# Altium schematic sheet SDRAM.SchDoc: SDRAM
size 420 x 297 mm; CompanyName: STMicroelectronics; Organization: Microcontrollers Division; DocumentNumber: 7; SheetNumber: 7; SheetTotal: 17
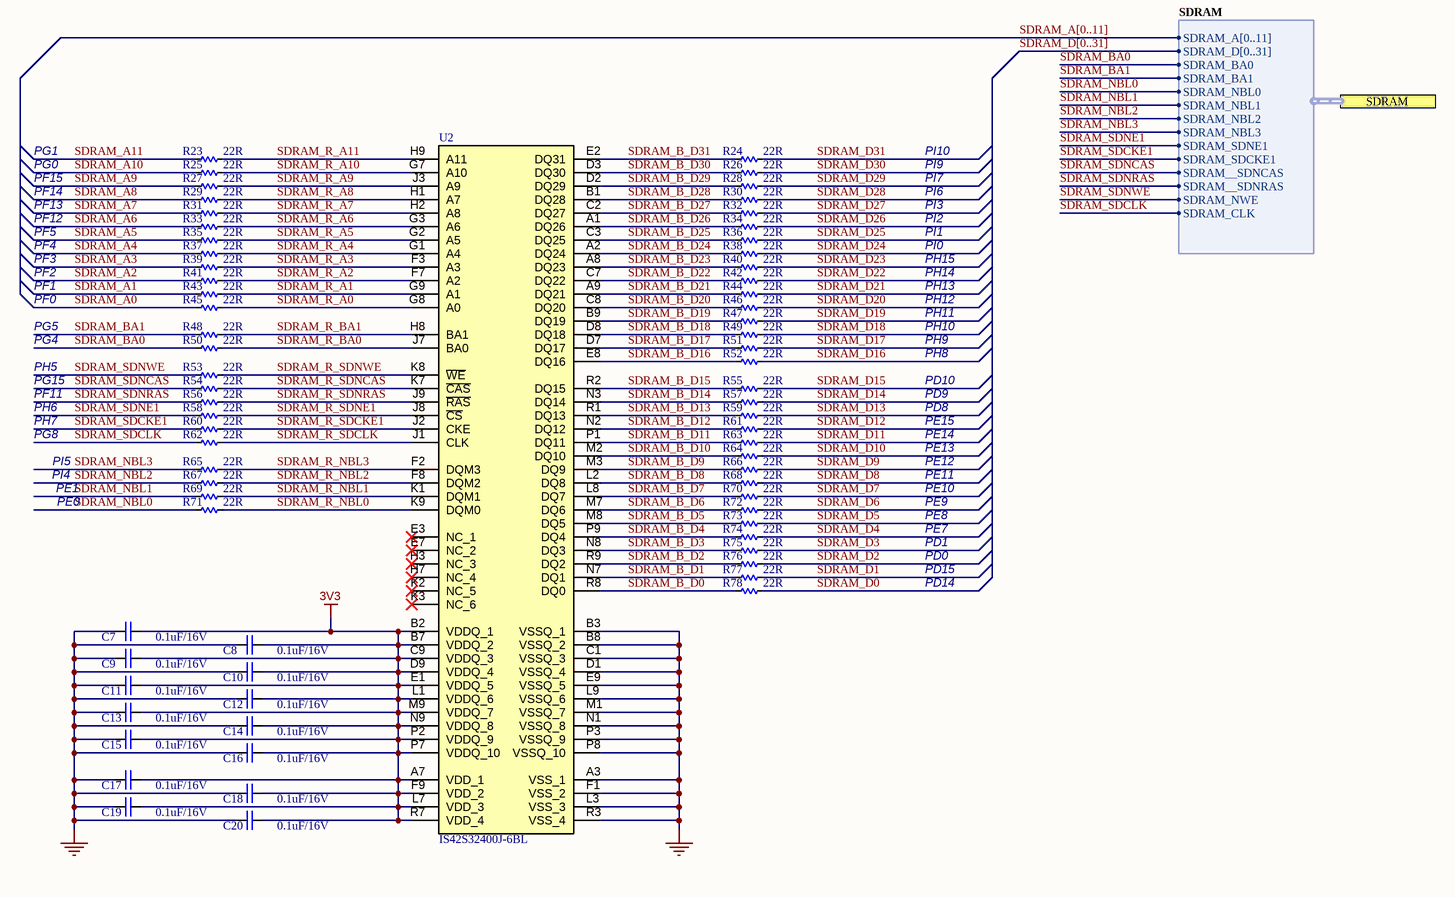
[diagram p0: SDRAM.SchDoc]

## Parts
C7  0.1uF/16V  [CAP_C_1608X80]
C8  0.1uF/16V  [CAP_C_1608X80]
C9  0.1uF/16V  [CAP_C_1608X80]
C10  0.1uF/16V  [CAP_C_1608X80]
C11  0.1uF/16V  [CAP_C_1608X80]
C12  0.1uF/16V  [CAP_C_1608X80]
C13  0.1uF/16V  [CAP_C_1608X80]
C14  0.1uF/16V  [CAP_C_1608X80]
C15  0.1uF/16V  [CAP_C_1608X80]
C16  0.1uF/16V  [CAP_C_1608X80]
C17  0.1uF/16V  [CAP_C_1608X80]
C18  0.1uF/16V  [CAP_C_1608X80]
C19  0.1uF/16V  [CAP_C_1608X80]
C20  0.1uF/16V  [CAP_C_1608X80]
R23  22R  [RES_C_1608X60]
R24  22R  [RES_C_1608X60]
R25  22R  [RES_C_1608X60]
R26  22R  [RES_C_1608X60]
R27  22R  [RES_C_1608X60]
R28  22R  [RES_C_1608X60]
R29  22R  [RES_C_1608X60]
R30  22R  [RES_C_1608X60]
R31  22R  [RES_C_1608X60]
R32  22R  [RES_C_1608X60]
R33  22R  [RES_C_1608X60]
R34  22R  [RES_C_1608X60]
R35  22R  [RES_C_1608X60]
R36  22R  [RES_C_1608X60]
R37  22R  [RES_C_1608X60]
R38  22R  [RES_C_1608X60]
R39  22R  [RES_C_1608X60]
R40  22R  [RES_C_1608X60]
R41  22R  [RES_C_1608X60]
R42  22R  [RES_C_1608X60]
R43  22R  [RES_C_1608X60]
R44  22R  [RES_C_1608X60]
R45  22R  [RES_C_1608X60]
R46  22R  [RES_C_1608X60]
R47  22R  [RES_C_1608X60]
R48  22R  [RES_C_1608X60]
R49  22R  [RES_C_1608X60]
R50  22R  [RES_C_1608X60]
R51  22R  [RES_C_1608X60]
R52  22R  [RES_C_1608X60]
R53  22R  [RES_C_1608X60]
R54  22R  [RES_C_1608X60]
R55  22R  [RES_C_1608X60]
R56  22R  [RES_C_1608X60]
R57  22R  [RES_C_1608X60]
R58  22R  [RES_C_1608X60]
R59  22R  [RES_C_1608X60]
R60  22R  [RES_C_1608X60]
R61  22R  [RES_C_1608X60]
R62  22R  [RES_C_1608X60]
R63  22R  [RES_C_1608X60]
R64  22R  [RES_C_1608X60]
R65  22R  [RES_C_1608X60]
R66  22R  [RES_C_1608X60]
R67  22R  [RES_C_1608X60]
R68  22R  [RES_C_1608X60]
R69  22R  [RES_C_1608X60]
R70  22R  [RES_C_1608X60]
R71  22R  [RES_C_1608X60]
R72  22R  [RES_C_1608X60]
R73  22R  [RES_C_1608X60]
R74  22R  [RES_C_1608X60]
R75  22R  [RES_C_1608X60]
R76  22R  [RES_C_1608X60]
R77  22R  [RES_C_1608X60]
R78  22R  [RES_C_1608X60]
U2  IS42S32400J-6BL  [BGA90C80P9X15_800X1300X120]

## Ports
SDRAM (harness SDRAM)

## Harnesses
SDRAM: SDRAM_A[0..11], SDRAM__SDNCAS, SDRAM_NBL0, SDRAM_SDNE1, SDRAM_SDCKE1, SDRAM_D[0..31], SDRAM_NBL1, SDRAM_BA0, SDRAM_BA1, SDRAM_NWE, SDRAM_CLK, SDRAM__SDNRAS, SDRAM_NBL3, SDRAM_NBL2

## Nets
3V3: C7.2 C8.2 C9.2 C10.2 C11.2 C12.2 C13.2 C14.2 C15.2 C16.2 C17.2 C18.2 C19.2 C20.2 U2.A7(VDD_1) U2.B2(VDDQ_1) U2.B7(VDDQ_2) U2.C9(VDDQ_3) U2.D9(VDDQ_4) U2.E1(VDDQ_5) U2.F9(VDD_2) U2.L1(VDDQ_6) U2.L7(VDD_3) U2.M9(VDDQ_7) U2.N9(VDDQ_8) U2.P2(VDDQ_9) U2.P7(VDDQ_10) U2.R7(VDD_4)
GND: C7.1 C8.1 C9.1 C10.1 C11.1 C12.1 C13.1 C14.1 C15.1 C16.1 C17.1 C18.1 C19.1 C20.1 U2.A3(VSS_1) U2.B3(VSSQ_1) U2.B8(VSSQ_2) U2.C1(VSSQ_3) U2.D1(VSSQ_4) U2.E9(VSSQ_5) U2.F1(VSS_2) U2.L3(VSS_3) U2.L9(VSSQ_6) U2.M1(VSSQ_7) U2.N1(VSSQ_8) U2.P3(VSSQ_9) U2.P8(VSSQ_10) U2.R3(VSS_4)
SDRAM_A0: R45.1
SDRAM_A1: R43.1
SDRAM_A2: R41.1
SDRAM_A3: R39.1
SDRAM_A4: R37.1
SDRAM_A5: R35.1
SDRAM_A6: R33.1
SDRAM_A7: R31.1
SDRAM_A8: R29.1
SDRAM_A9: R27.1
SDRAM_A10: R25.1
SDRAM_A11: R23.1
SDRAM_B_D0: R78.1 U2.R8(DQ0)
SDRAM_B_D1: R77.1 U2.N7(DQ1)
SDRAM_B_D2: R76.1 U2.R9(DQ2)
SDRAM_B_D3: R75.1 U2.N8(DQ3)
SDRAM_B_D4: R74.1 U2.P9(DQ4)
SDRAM_B_D5: R73.1 U2.M8(DQ5)
SDRAM_B_D6: R72.1 U2.M7(DQ6)
SDRAM_B_D7: R70.1 U2.L8(DQ7)
SDRAM_B_D8: R68.1 U2.L2(DQ8)
SDRAM_B_D9: R66.1 U2.M3(DQ9)
SDRAM_B_D10: R64.1 U2.M2(DQ10)
SDRAM_B_D11: R63.1 U2.P1(DQ11)
SDRAM_B_D12: R61.1 U2.N2(DQ12)
SDRAM_B_D13: R59.1 U2.R1(DQ13)
SDRAM_B_D14: R57.1 U2.N3(DQ14)
SDRAM_B_D15: R55.1 U2.R2(DQ15)
SDRAM_B_D16: R52.1 U2.E8(DQ16)
SDRAM_B_D17: R51.1 U2.D7(DQ17)
SDRAM_B_D18: R49.1 U2.D8(DQ18)
SDRAM_B_D19: R47.1 U2.B9(DQ19)
SDRAM_B_D20: R46.1 U2.C8(DQ20)
SDRAM_B_D21: R44.1 U2.A9(DQ21)
SDRAM_B_D22: R42.1 U2.C7(DQ22)
SDRAM_B_D23: R40.1 U2.A8(DQ23)
SDRAM_B_D24: R38.1 U2.A2(DQ24)
SDRAM_B_D25: R36.1 U2.C3(DQ25)
SDRAM_B_D26: R34.1 U2.A1(DQ26)
SDRAM_B_D27: R32.1 U2.C2(DQ27)
SDRAM_B_D28: R30.1 U2.B1(DQ28)
SDRAM_B_D29: R28.1 U2.D2(DQ29)
SDRAM_B_D30: R26.1 U2.D3(DQ30)
SDRAM_B_D31: R24.1 U2.E2(DQ31)
SDRAM_BA0: R50.1 ; port SDRAM.SDRAM_BA0
SDRAM_BA1: R48.1 ; port SDRAM.SDRAM_BA1
SDRAM_D0: R78.2
SDRAM_D1: R77.2
SDRAM_D2: R76.2
SDRAM_D3: R75.2
SDRAM_D4: R74.2
SDRAM_D5: R73.2
SDRAM_D6: R72.2
SDRAM_D7: R70.2
SDRAM_D8: R68.2
SDRAM_D9: R66.2
SDRAM_D10: R64.2
SDRAM_D11: R63.2
SDRAM_D12: R61.2
SDRAM_D13: R59.2
SDRAM_D14: R57.2
SDRAM_D15: R55.2
SDRAM_D16: R52.2
SDRAM_D17: R51.2
SDRAM_D18: R49.2
SDRAM_D19: R47.2
SDRAM_D20: R46.2
SDRAM_D21: R44.2
SDRAM_D22: R42.2
SDRAM_D23: R40.2
SDRAM_D24: R38.2
SDRAM_D25: R36.2
SDRAM_D26: R34.2
SDRAM_D27: R32.2
SDRAM_D28: R30.2
SDRAM_D29: R28.2
SDRAM_D30: R26.2
SDRAM_D31: R24.2
SDRAM_NBL0: R71.1 ; port SDRAM.SDRAM_NBL0
SDRAM_NBL1: R69.1 ; port SDRAM.SDRAM_NBL1
SDRAM_NBL2: R67.1 ; port SDRAM.SDRAM_NBL2
SDRAM_NBL3: R65.1 ; port SDRAM.SDRAM_NBL3
SDRAM_R_A0: R45.2 U2.G8(A0)
SDRAM_R_A1: R43.2 U2.G9(A1)
SDRAM_R_A2: R41.2 U2.F7(A2)
SDRAM_R_A3: R39.2 U2.F3(A3)
SDRAM_R_A4: R37.2 U2.G1(A4)
SDRAM_R_A5: R35.2 U2.G2(A5)
SDRAM_R_A6: R33.2 U2.G3(A6)
SDRAM_R_A7: R31.2 U2.H2(A8)
SDRAM_R_A8: R29.2 U2.H1(A7)
SDRAM_R_A9: R27.2 U2.J3(A9)
SDRAM_R_A10: R25.2 U2.G7(A10)
SDRAM_R_A11: R23.2 U2.H9(A11)
SDRAM_R_BA0: R50.2 U2.J7(BA0)
SDRAM_R_BA1: R48.2 U2.H8(BA1)
SDRAM_R_NBL0: R71.2 U2.K9(DQM0)
SDRAM_R_NBL1: R69.2 U2.K1(DQM1)
SDRAM_R_NBL2: R67.2 U2.F8(DQM2)
SDRAM_R_NBL3: R65.2 U2.F2(DQM3)
SDRAM_R_SDCKE1: R60.2 U2.J2(CKE)
SDRAM_R_SDCLK: R62.2 U2.J1(CLK)
SDRAM_R_SDNCAS: R54.2 U2.K7(~{CAS})
SDRAM_R_SDNE1: R58.2 U2.J8(~{CS})
SDRAM_R_SDNRAS: R56.2 U2.J9(~{RAS})
SDRAM_R_SDNWE: R53.2 U2.K8(~{WE})
SDRAM_SDCKE1: R60.1 ; port SDRAM.SDRAM_SDCKE1
SDRAM_SDCLK: R62.1 ; port SDRAM.SDRAM_CLK
SDRAM_SDNCAS: R54.1 ; port SDRAM.SDRAM__SDNCAS
SDRAM_SDNE1: R58.1 ; port SDRAM.SDRAM_SDNE1
SDRAM_SDNRAS: R56.1 ; port SDRAM.SDRAM__SDNRAS
SDRAM_SDNWE: R53.1 ; port SDRAM.SDRAM_NWE

Not connected (* = marked no-connect by the designer): U2 E3(NC_1)* E7(NC_2)* H3(NC_3)* H7(NC_4)* K2(NC_5)* K3(NC_6)*

## Buses and harness runs
bus SDRAM_A[0..11]
bus SDRAM_D[0..31]

## Notes on the sheet
- PG0
- PG1
- PI10
- PI9
- PF5
- PF12
- PF13
- PF14
- PF15
- PI7
- PI6
- PI3
- PI2
- PI1
- PF0
- PF1
- PF2
- PF3
- PF4
- PI0
- PH15
- PH14
- PH13
- PH12
- PH5
- PG4
- PG5
- PH11
- PH10
- PH9
- PH8
- PF11
- PH6
- PH7
- PG8
- PG15
- PE14
- PE15
- PD8
- PD9
- PD10
- PI4
- PI5
- PE1
- PE0
- PE9
- PE10
- PE11
- PE12
- PE13
- PE7
- PE8
- PD15
- PD0
- PD1
- PD14
- Project:
- BEE-PC1
- Sub-system:
- NANORACK_EXP_CONTROLLER
- Design by:
- SANG HUYNH
- BAO BUI Q.
- Sheet title:
- Sheet
- A3
- of
- Checked by:
- Approved by:
- VU PHAM
- Revision:
- Document No:
- V1.2.2
- Size:
- Date:

## Library data of the parts
C7-C20 = CAP_SMD: CAP_Chip; Value: 33pF
R23-R78 = _RES_B_2: RES
U2 = IS42S32400J-6BL: DRAM 128M, 3.3V, SDRAM, 4Mx32, 166Mhz, 90 ball BGA (8mmx13mm) RoHS; Manufacturer_Name: Integrated Silicon Solution Inc.; Geometry.Height: 1.2mm; Manufacturer_Part_Number: IS42S32400J-6BL; Mouser Part Number: *; Mouser Price/Stock: *; Arrow Part Number: IS42S32400J-6BL; Arrow Price/Stock: https://www.arrow.com/en/products/is42s32400j-6bl/integrated-silicon-solution-inc?utm_currency=USD&region=nac; Datasheet Link: https://www.issi.com/WW/pdf/42-45S32400J.pdf